# EAGLE design TSOC_USBUART2 (EAGLE 6.6.0)
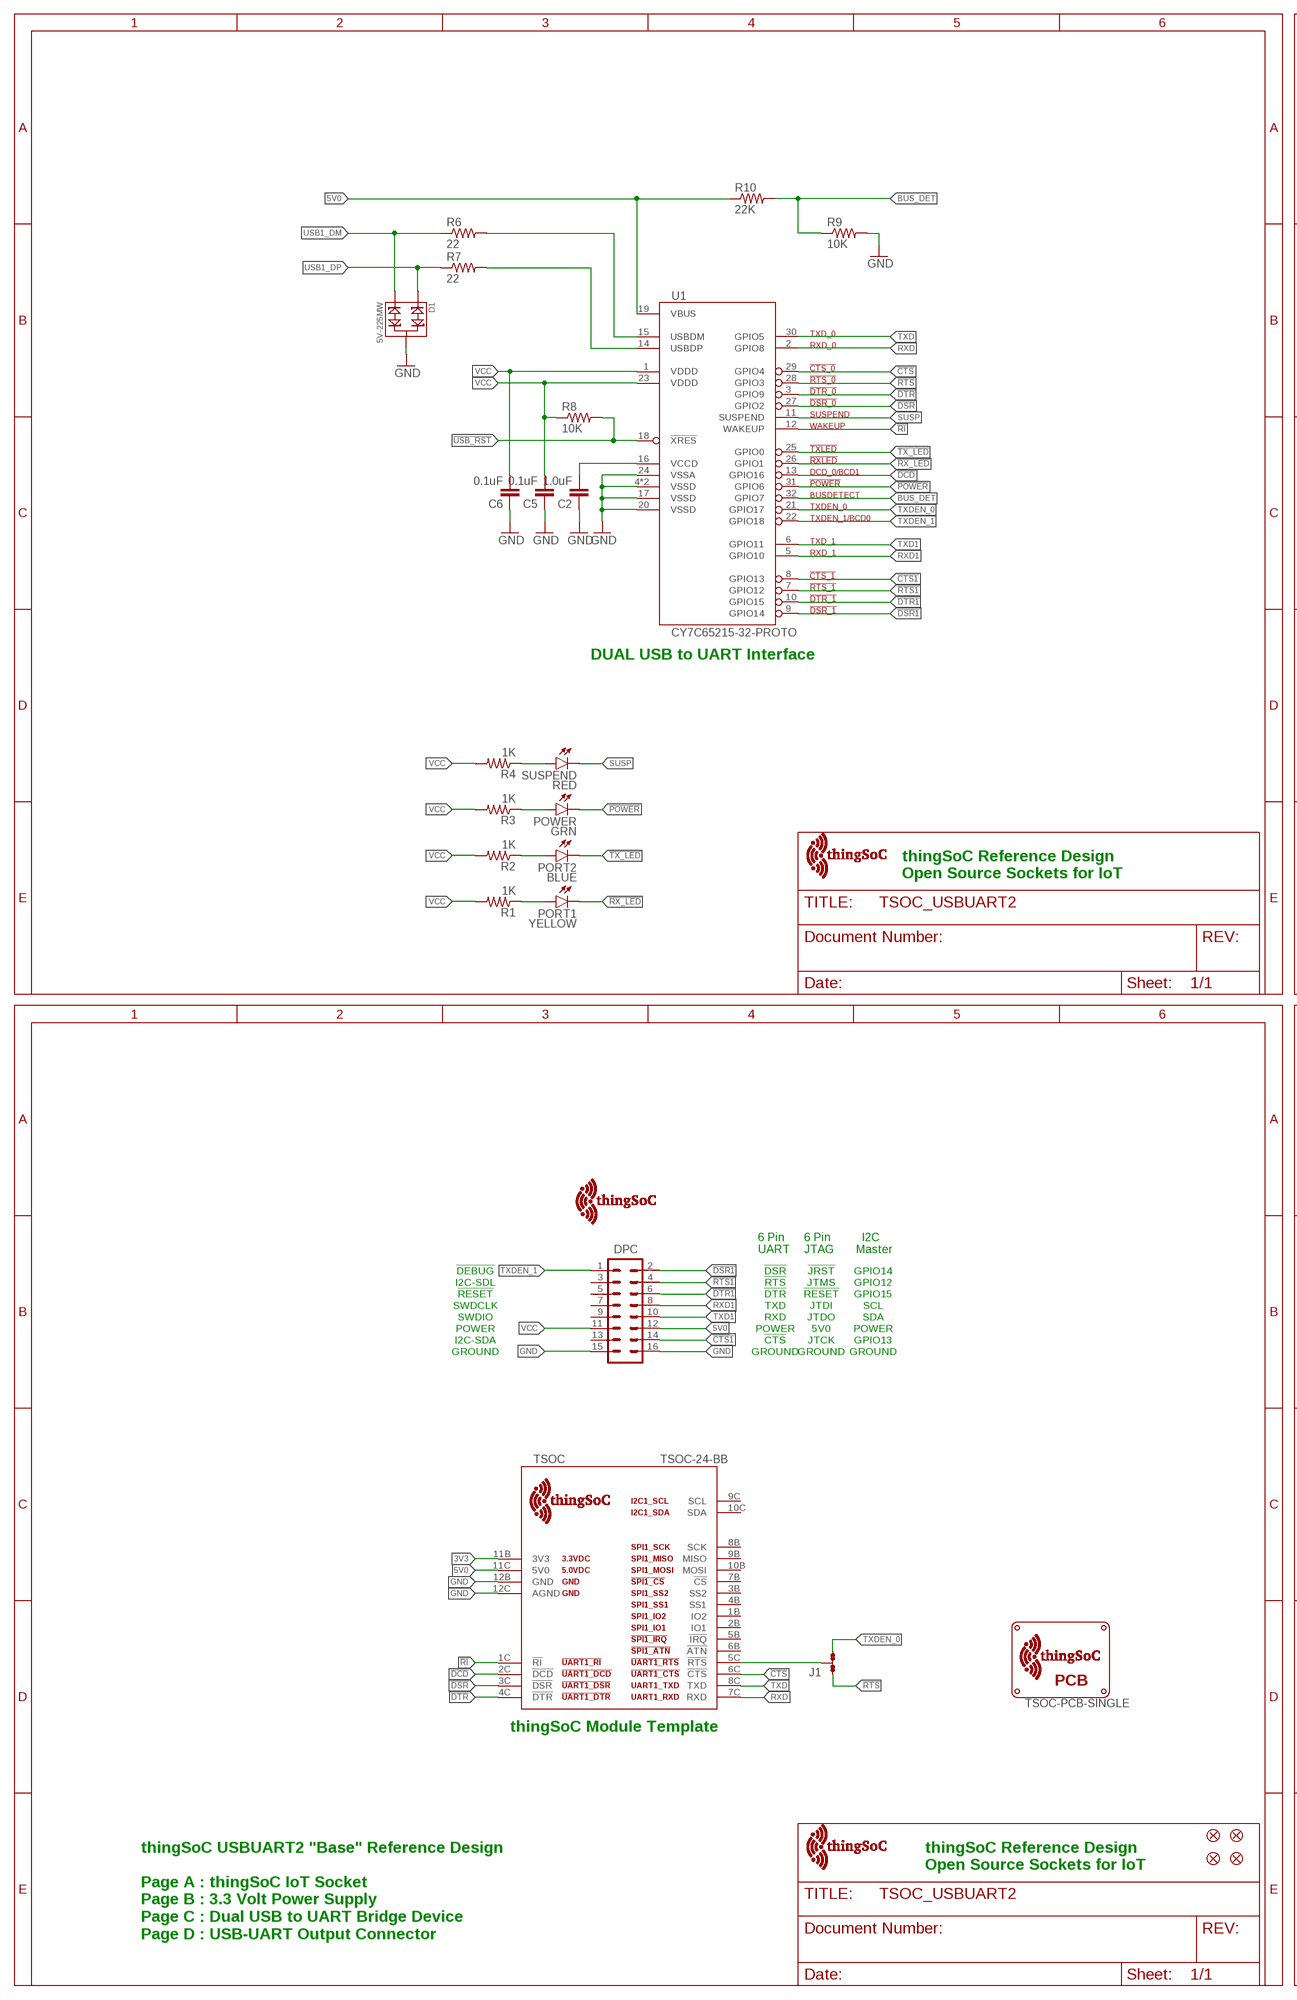
[diagram p0: schematic, sheet 1, part 1 of 2]
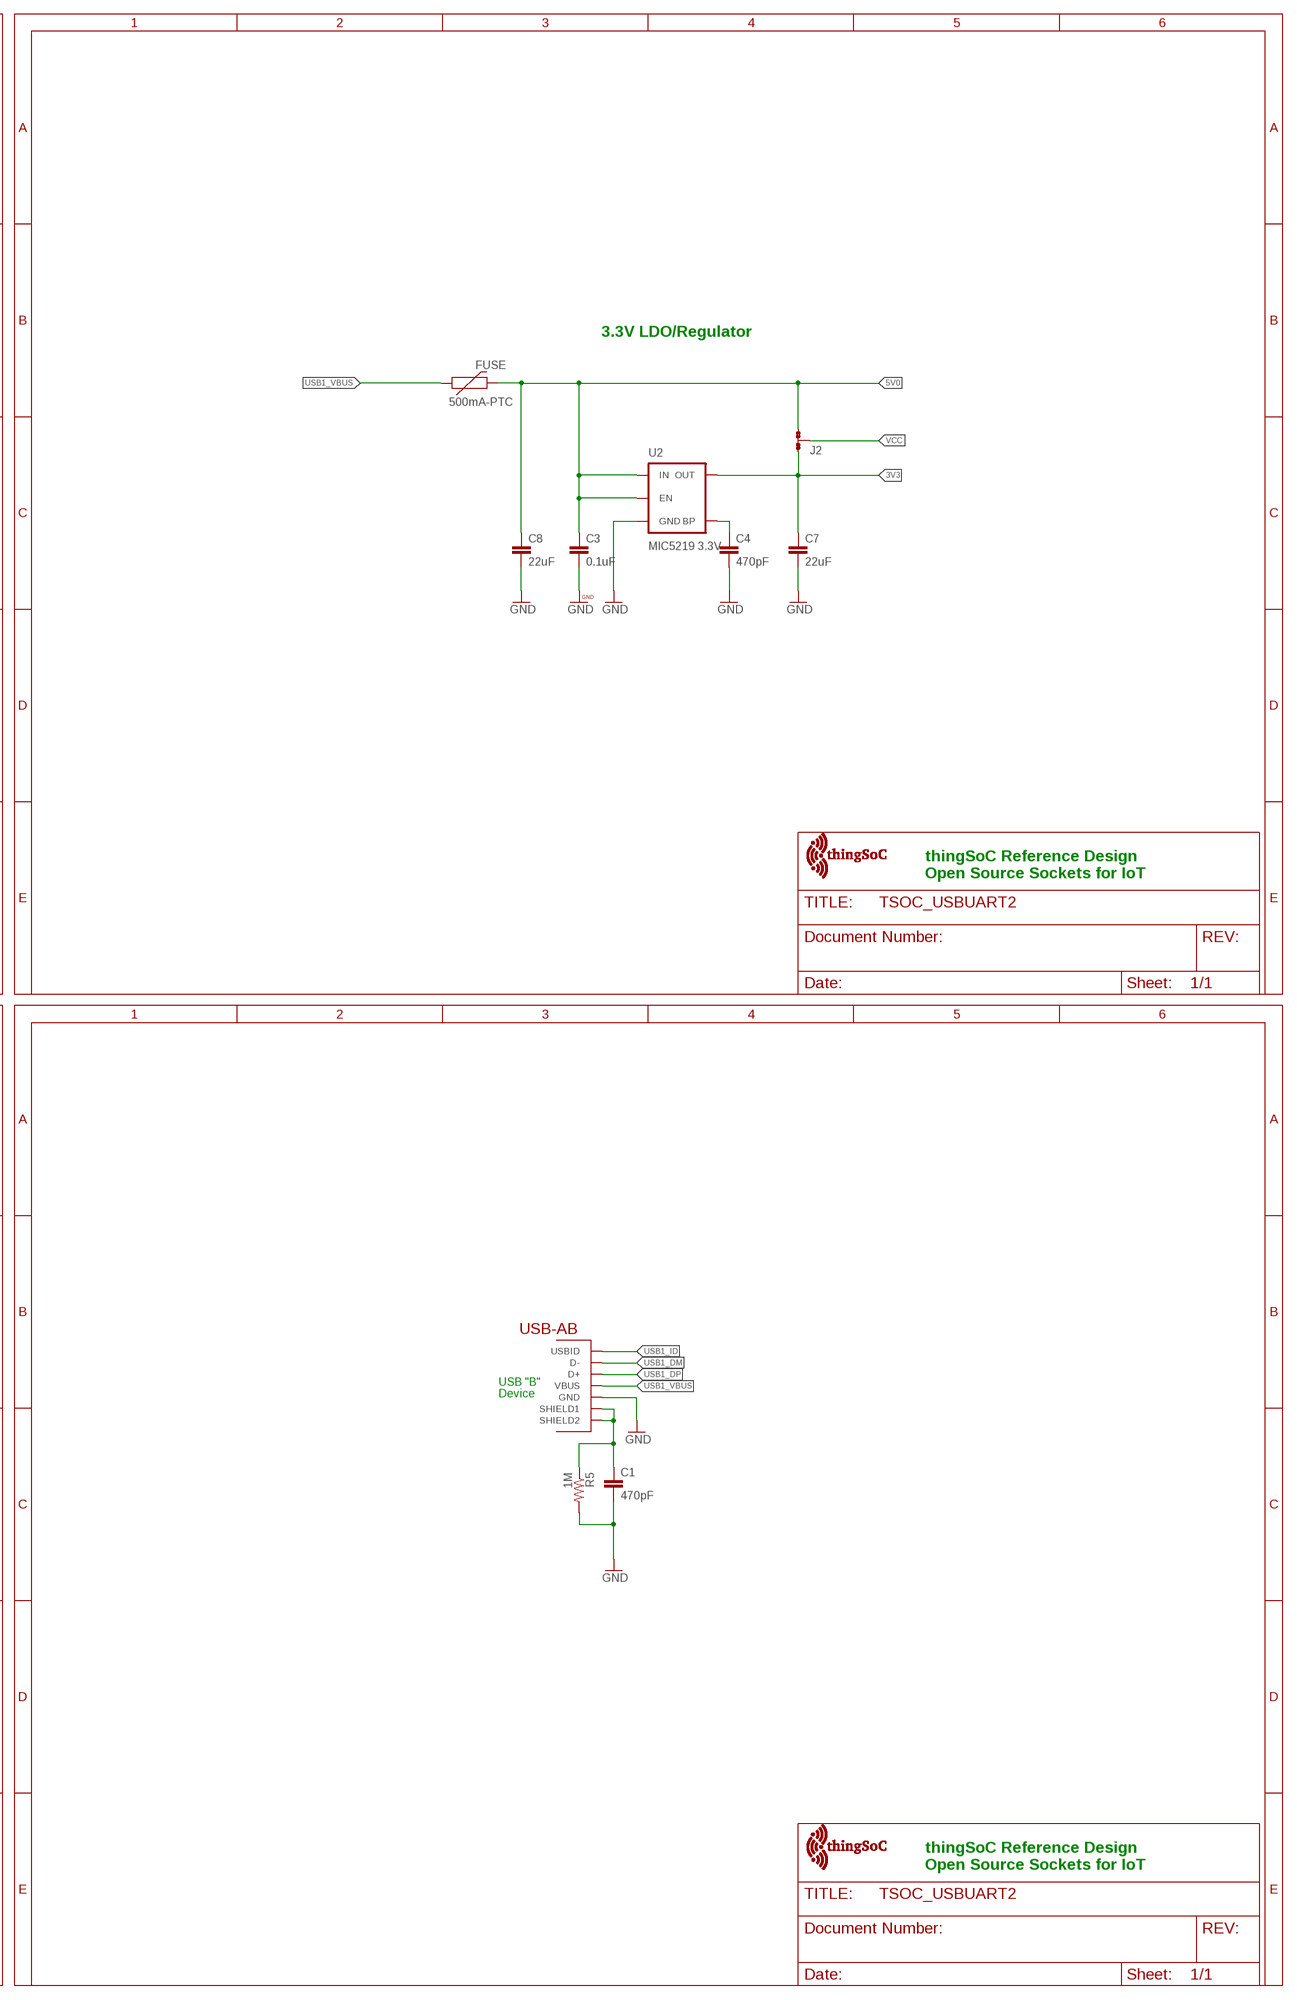
[diagram p1: schematic, sheet 1, part 2 of 2]

## Parts
$$U$2  TSOC-LOGO  [TSOC-LOGO-BLANK]
C1  470pF  CAP-0603  [EIA-0603]
C2  1.0uF  CAP-0603  [EIA-0603]
C3  0.1uF  CAP-0603  [EIA-0603]
C4  470pF  CAP-0603  [EIA-0603]
C5  0.1uF  CAP-0603  [EIA-0603]
C6  0.1uF  CAP-0603  [EIA-0603]
C7  22uF  CAP-1206  [EIA-1206]
C8  22uF  CAP-1206  [EIA-1206]
D1  5V-225MW  SMD-DIODE-TVS-5V-225MW(SOT-23)  [SOT-23]
DPC  M08X2  [2X8]
FID1  FIDUCIALUFIDUCIAL  [MICRO-FIDUCIAL]
FID2  FIDUCIALUFIDUCIAL  [MICRO-FIDUCIAL]
FID3  FIDUCIALUFIDUCIAL  [MICRO-FIDUCIAL]
FID4  FIDUCIALUFIDUCIAL  [MICRO-FIDUCIAL]
FUSE  500mA-PTC  PTCSMD  [PTC-1206]
J1  JMP-3-1_2  [JMP-3-1_2]
J2  JMP-3-1_2  [JMP-3-1_2]
PORT1  YELLOW  LED0603  [LED-0603]
PORT2  BLUE  LED0603  [LED-0603]
POWER  GRN  LED0603  [LED-0603]
R1  1K  RESISTOR-0603  [EIA-0603]
R2  1K  RESISTOR-0603  [EIA-0603]
R3  1K  RESISTOR-0603  [EIA-0603]
R4  1K  RESISTOR-0603  [EIA-0603]
R5  1M  RESISTOR-0603  [EIA-0603]
R6  22  RESISTOR-0603  [EIA-0603]
R7  22  RESISTOR-0603  [EIA-0603]
R8  10K  RESISTOR-0603  [EIA-0603]
R9  10K  RESISTOR-0603  [EIA-0603]
R10  22K  RESISTOR-0603  [EIA-0603]
SUSPEND  RED  LED0603  [LED-0603]
TSOC  TSOC-24-BB  [TSOC-BB-S24]
U1  CY7C65215-32-PROTO  [QFN32-PROTO]
U2  MIC5219 3.3V  V_REG_MIC52193.3V  [SOT23-5]
U$1  TSOC-LOGO  [TSOC-LOGO-BLANK]
U$3  TSOC-LOGO  [TSOC-LOGO-BLANK]
U$4  TSOC-PCB-SINGLE  [TSOC-BB-BRD-DIM]
U$6  TSOC-LOGO-SMALL  [TSOC-LOGO-SML]
U$100  TSOC-LOGO-LRG  [TSOC-LOGO-LRG]
USB  USB_AB  [USB-AB-MICRO-SMD]

## Nets
3V3: C7.1 J2.1 TSOC.11B(3V3) U2.5(OUT)
5V0: C3.1 C8.1 DPC.12 FUSE.2 J2.3 R10.1 TSOC.11C(5V0) U1.19(VBUS) U2.1(IN) U2.3(EN)
!CTS: TSOC.6C(!CTS) U1.29(GPIO4)
!CTS1: DPC.14 U1.8(GPIO13)
!DCD: TSOC.2C(!DCD) U1.13(GPIO16)
!DSR: TSOC.3C(!DSR) U1.27(GPIO2)
!DSR1: DPC.2 U1.9(GPIO14)
!DTR: TSOC.4C(!DTR) U1.3(GPIO9)
!DTR1: DPC.6 U1.10(GPIO15)
!POWER: POWER.C U1.31(GPIO6)
!RI: TSOC.1C(!RI) U1.12(WAKEUP)
!RTS: J1.1 U1.28(GPIO3)
!RTS1: DPC.4 U1.7(GPIO12)
!RX_LED: PORT1.C U1.26(GPIO1)
!TX_LED: PORT2.C U1.25(GPIO0)
!USB_RST: R8.2 U1.18(!XRES)
BLU: PORT2.A R2.1
BUS_DET: R9.1 R10.2 U1.32(GPIO7)
BYPASS1: C4.1 U2.4(BP)
GND [vcc]: C1.2 C2.1 C3.2 C4.2 C5.1 C6.1 C7.2 C8.2 D1.3 DPC.15 DPC.16 R5.2 R9.2 TSOC.12B(GND) TSOC.12C(AGND) U1.4(VSSD) U1.17(VSSD) U1.20(VSSD) U1.24(VSSA) U1.EXP(VSSD) U2.2(GND) USB.GND
GRN: POWER.A R3.1
N$1: J1.2 TSOC.5C(!RTS)
RED: R4.1 SUSPEND.A
RXD: TSOC.7C(RXD) U1.2(GPIO8)
RXD1: DPC.8 U1.5(GPIO10)
SUSP: SUSPEND.C U1.11(SUSPEND)
TXD: TSOC.8C(TXD) U1.30(GPIO5)
TXD1: DPC.10 U1.6(GPIO11)
TXDEN_0: J1.3 U1.21(GPIO17)
TXDEN_1: DPC.1 U1.22(GPIO18)
USB1_DM: D1.2 R6.1 USB.D-
USB1_DP: D1.1 R7.1 USB.D+
USB1_ID: USB.ID(USBID)
USB1_M: R6.2 U1.15(USBDM)
USB1_P: R7.2 U1.14(USBDP)
USB1_SHIELD: C1.1 R5.1 USB.SHIELD1 USB.SHIELD2
USB1_VBUS: FUSE.1 USB.VBUS
VCC: C5.2 C6.2 DPC.11 J2.2 R1.2 R2.2 R3.2 R4.2 R8.1 U1.1(VDDD) U1.23(VDDD)
VCCD1: C2.2 U1.16(VCCD)
YEL: PORT1.A R1.1
Unconnected: DPC.3 DPC.5 DPC.7 DPC.9 DPC.13 TSOC.1B(IO2) TSOC.2B(IO1) TSOC.3B(SS2) TSOC.4B(SS1) TSOC.5B(!IRQ) TSOC.6B(!ATN) TSOC.7B(!CS) TSOC.8B(SCK) TSOC.9B(MISO) TSOC.9C(SCL) TSOC.10B(MOSI) TSOC.10C(SDA)

## Notes on the sheet
- 3.3V LDO/Regulator
- DUAL USB to UART Interface
- thingSoC Reference Design
  Open Source Sockets for IoT
- thingSoC Reference Design
  Open Source Sockets for IoT
- 6 Pin
  UART
- 6 Pin
  JTAG
- I2C
  Master
- !DEBUG | !DSR | !JRST | GPIO14
- I2C-SDL | !RTS | JTMS | GPIO12
- !RESET | !DTR | !RESET | GPIO15
- SWDCLK | TXD | JTDI | SCL
- SWDIO | RXD | JTDO | SDA
- POWER | POWER | 5V0 | POWER
- I2C-SDA | !CTS | JTCK | GPIO13
- GROUND | GROUND | GROUND | GROUND
- USB "B"
- Device
- thingSoC Module Template
- thingSoC Reference Design
  Open Source Sockets for IoT
- thingSoC Reference Design
  Open Source Sockets for IoT
- thingSoC USBUART2 "Base" Reference Design
  
  Page A : thingSoC IoT Socket
  Page B : 3.3 Volt Power Supply
  Page C : Dual USB to UART Bridge Device
  Page D : USB-UART Output Connector

## Library data of the parts
$$U$2 U$1 U$3 U$6 U$100 = thingSoC:TSOC-LOGO: thingSoC Logo Source LBR : http://www.thingsoc.com Github : https://github.com/thingsoc License : http://creativecommons.org/licenses/by-sa/4.0/ (Creative Commons 4.0) THIS SOFTWARE IS PROVIDED BY THE CONTRIBUTORS "AS IS" AND WITHOUT ANY EXPRESS OR IMPLIED WARRANTIES, INCLUDING, BUT NOT LIMITED TO, THE IMPLIED WARRANTIES OF MERCHANTABILITY AND FITNESS FOR A PARTICULAR PURPOSE ARE DISCLAIMED. IN NO EVENT SHALL THE COPYRIGHT OWNER OR CONTRIBUTORS BE LIABLE FOR ANY DIRECT, INDIRECT, INCIDENTAL, SPECIAL, EXEMPLARY, OR CONSEQUENTIAL DAMAGES (INCLUDING, BUT NOT LIMITED TO, PROCUREMENT OF SUBSTITUTE GOODS OR SERVICES; LOSS OF USE, DATA, OR PROFITS; OR BUSINESS INTERRUPTION) HOWEVER CAUSED AND ON ANY THEORY OF LIABILITY, WHETHER IN CONTRACT, STRICT LIABILITY, OR TORT (INCLUDING NEGLIGENCE OR OTHERWISE) ARISING IN ANY WAY OUT OF THE USE OF THIS SOFTWARE, EVEN IF ADVISED OF THE POSSIBILITY OF SUCH DAMAGE.
C1-C8 = TSOC_USBUART2:CAP: Ceramic Capacitor SMD
D1 = Seeed-Diode-2016:SMD-DIODE-TVS-5V-225MW(SOT-23): 304050003; MPN: CESD5V0AP
DPC = PatternAgents-ProtoPads:M08X2: .1" headers, two rows of 8 each
FID1-FID4 = TSOC-ESP8266-BASE:FIDUCIAL: Fiducial Alignment Points Various fiducial points for machine vision alignment.
FUSE = SparkFun:PTC: Resettable Fuse PTC Resettable Fuse. Spark Fun Electronics SKU : COM-08357
J1 J2 = PatternAgents-ProtoPads:JMP-3-1_2: Three Terminal Jumper - 1 & 2 Connected Positions 1and 2 are normally connected. PatternAgents ProtoPads Library Schematic and PCB layout libraries for design patterns by PatternAgents. For the CADSoft Eagle CAD program : http://www.cadsoftusa.com/download-eagle/ Source LBR : http://www.patternagents.com Github : https://github.com/PatternAgents License : http://creativecommons.org/licenses/by-sa/4.0/ (Creative Commons 4.0) THIS SOFTWARE IS PROVIDED BY THE CONTRIBUTORS "AS IS" AND WITHOUT ANY EXPRESS OR IMPLIED WARRANTIES, INCLUDING, BUT NOT LIMITED TO, THE IMPLIED WARRANTIES OF MERCHANTABILITY AND FITNESS FOR A PARTICULAR PURPOSE ARE DISCLAIMED. IN NO EVENT SHALL THE COPYRIGHT OWNER OR CONTRIBUTORS BE LIABLE FOR ANY DIRECT, INDIRECT, INCIDENTAL, SPECIAL, EXEMPLARY, OR CONSEQUENTIAL DAMAGES (INCLUDING, BUT NOT LIMITED TO, PROCUREMENT OF SUBSTITUTE GOODS OR SERVICES; LOSS OF USE, DATA, OR PROFITS; OR BUSINESS INTERRUPTION) HOWEVER CAUSED AND ON ANY THEORY OF LIABILITY, WHETHER IN CONTRACT, STRICT LIABILITY, OR TORT (INCLUDING NEGLIGENCE OR OTHERWISE) ARISING IN ANY WAY OUT OF THE USE OF THIS SOFTWARE, EVEN IF ADVISED OF THE POSSIBILITY OF SUCH DAMAGE.; BOM: EXCLUDE
PORT1 PORT2 POWER SUSPEND = TSOC-ESP8266-BASE:LED: LEDs Standard schematic elements and footprints for 5mm, 3mm, 1206, and 0603 sized LEDs. 5mm - Spark Fun Electronics SKU : COM-00529 (and others)
R1-R10 = TSOC_USBUART2:RESISTOR
TSOC = thingSoC:TSOC-24: thingSoC Twenty-Four(24) Pin Socket Source LBR : http://www.thingsoc.com Github : https://github.com/thingsoc License : http://creativecommons.org/licenses/by-sa/4.0/ (Creative Commons 4.0) THIS SOFTWARE IS PROVIDED BY THE CONTRIBUTORS "AS IS" AND WITHOUT ANY EXPRESS OR IMPLIED WARRANTIES, INCLUDING, BUT NOT LIMITED TO, THE IMPLIED WARRANTIES OF MERCHANTABILITY AND FITNESS FOR A PARTICULAR PURPOSE ARE DISCLAIMED. IN NO EVENT SHALL THE COPYRIGHT OWNER OR CONTRIBUTORS BE LIABLE FOR ANY DIRECT, INDIRECT, INCIDENTAL, SPECIAL, EXEMPLARY, OR CONSEQUENTIAL DAMAGES (INCLUDING, BUT NOT LIMITED TO, PROCUREMENT OF SUBSTITUTE GOODS OR SERVICES; LOSS OF USE, DATA, OR PROFITS; OR BUSINESS INTERRUPTION) HOWEVER CAUSED AND ON ANY THEORY OF LIABILITY, WHETHER IN CONTRACT, STRICT LIABILITY, OR TORT (INCLUDING NEGLIGENCE OR OTHERWISE) ARISING IN ANY WAY OUT OF THE USE OF THIS SOFTWARE, EVEN IF ADVISED OF THE POSSIBILITY OF SUCH DAMAGE.
U1 = PatternAgents-Cypress:CY7C65215-32: Cypress EZ-USB ® CY7C65215-32QFN DUAL CHANNEL USB TO UART/SPI/IC Bridge Full-Speed USB Peripheral Controller Source Data: http://www.cypress.com/?mpn=CY7C65211-24QFN LBR Source: http://www.patternagents.com THIS SOFTWARE IS PROVIDED BY THE CONTRIBUTORS "AS IS" AND WITHOUT ANY EXPRESS OR IMPLIED WARRANTIES, INCLUDING, BUT NOT LIMITED TO, THE IMPLIED WARRANTIES OF MERCHANTABILITY AND FITNESS FOR A PARTICULAR PURPOSE ARE DISCLAIMED. IN NO EVENT SHALL THE COPYRIGHT OWNER OR CONTRIBUTORS BE LIABLE FOR ANY DIRECT, INDIRECT, INCIDENTAL, SPECIAL, EXEMPLARY, OR CONSEQUENTIAL DAMAGES (INCLUDING, BUT NOT LIMITED TO, PROCUREMENT OF SUBSTITUTE GOODS OR SERVICES; LOSS OF USE, DATA, OR PROFITS; OR BUSINESS INTERRUPTION) HOWEVER CAUSED AND ON ANY THEORY OF LIABILITY, WHETHER IN CONTRACT, STRICT LIABILITY, OR TORT (INCLUDING NEGLIGENCE OR OTHERWISE) ARISING IN ANY WAY OUT OF THE USE OF THIS SOFTWARE, EVEN IF ADVISED OF THE POSSIBILITY OF SUCH DAMAGE.
U2 = TSOC-ESP8266-BASE:V_REG_MIC5219: V_REG MIC5219 Standard 3.3V and 5V 500mA LDO voltage regulator in SOT-23 layout. Micrel part MIC5219. BP (by-pass) pin is used to lower output noise with 470pF cap, may be left open.; PROD_ID: VREG-09872
U$4 = thingSoC:TSOC-PCB: thingSoC PCB Outlines Boards Outlines for Standard Sizes (in the DImension Layer) (Registration marks in the tDocu layer - make sure to turn on tDocu/bDocu) Source LBR : http://www.thingsoc.com Github : https://github.com/thingsoc License : http://creativecommons.org/licenses/by-sa/4.0/ (Creative Commons 4.0) THIS SOFTWARE IS PROVIDED BY THE CONTRIBUTORS "AS IS" AND WITHOUT ANY EXPRESS OR IMPLIED WARRANTIES, INCLUDING, BUT NOT LIMITED TO, THE IMPLIED WARRANTIES OF MERCHANTABILITY AND FITNESS FOR A PARTICULAR PURPOSE ARE DISCLAIMED. IN NO EVENT SHALL THE COPYRIGHT OWNER OR CONTRIBUTORS BE LIABLE FOR ANY DIRECT, INDIRECT, INCIDENTAL, SPECIAL, EXEMPLARY, OR CONSEQUENTIAL DAMAGES (INCLUDING, BUT NOT LIMITED TO, PROCUREMENT OF SUBSTITUTE GOODS OR SERVICES; LOSS OF USE, DATA, OR PROFITS; OR BUSINESS INTERRUPTION) HOWEVER CAUSED AND ON ANY THEORY OF LIABILITY, WHETHER IN CONTRACT, STRICT LIABILITY, OR TORT (INCLUDING NEGLIGENCE OR OTHERWISE) ARISING IN ANY WAY OUT OF THE USE OF THIS SOFTWARE, EVEN IF ADVISED OF THE POSSIBILITY OF SUCH DAMAGE.
USB = BeeSafe:USB_AB: This is a USB AB connector that is compatible with USB OTG. i.e. this connector can serve as a host or device

## Net classes
1 vcc: width 0.254 mm

## Board
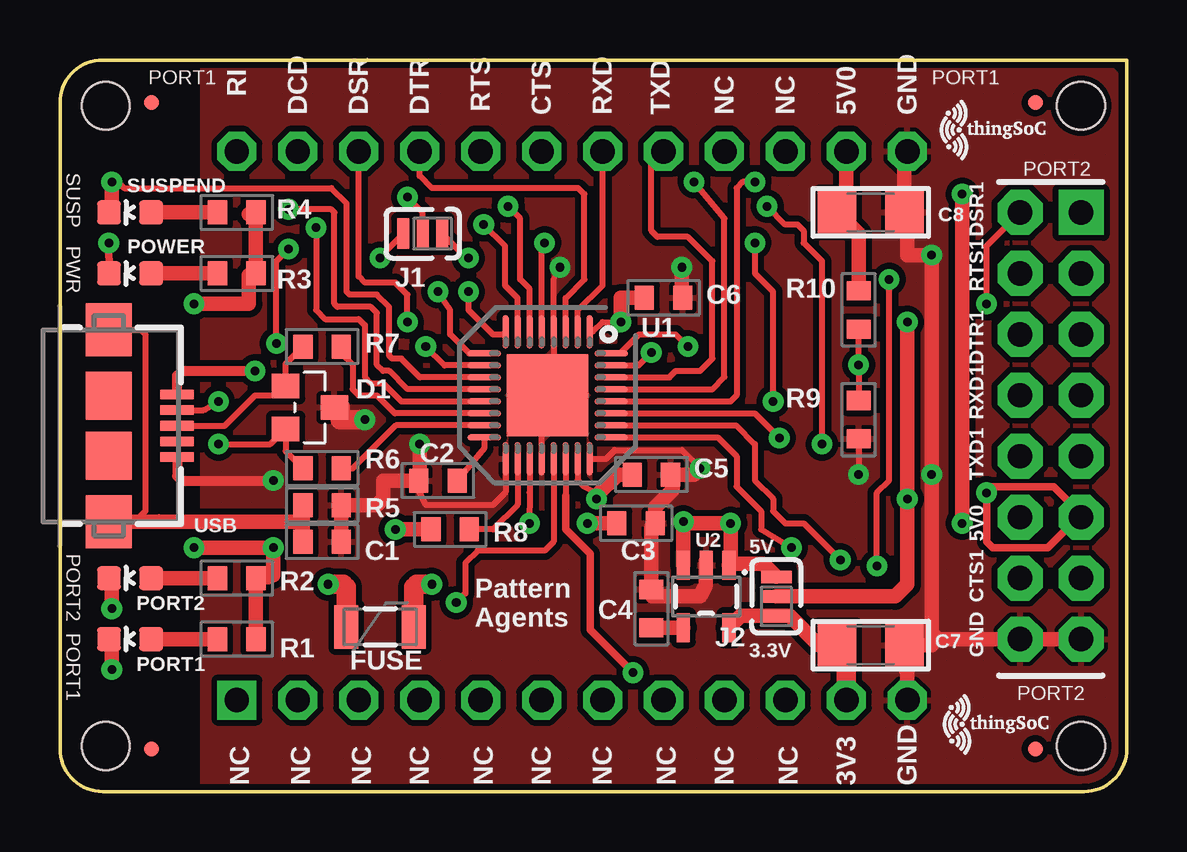
[diagram p2: board, top side]
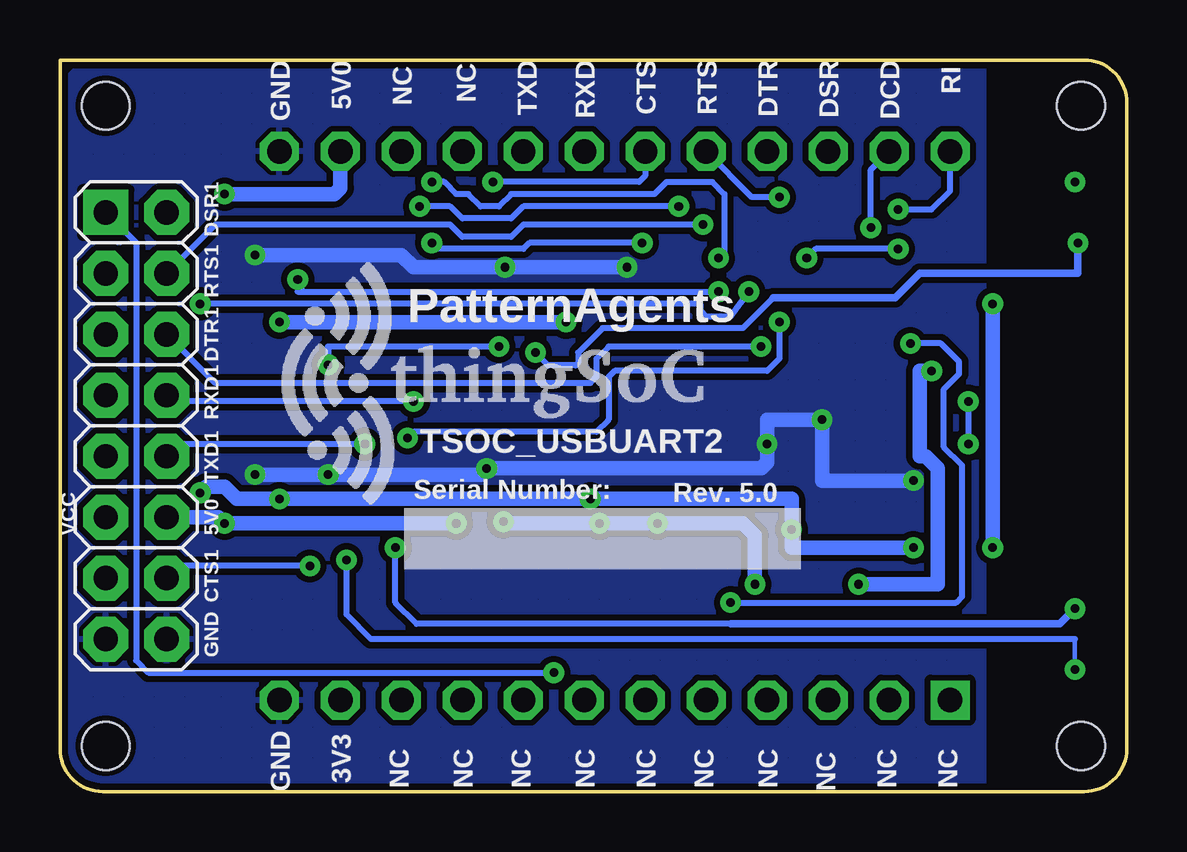
[diagram p3: board, bottom side, seen from below]

Size 44.45 x 30.48 mm. Coordinates in mm from the lower left corner, seen from the top.
Copper layers (1*16): Top 0.035mm / dielectric 1.5mm / Bottom 0.035mm
Design rules "PatternAgents_7mil": minimum track width 7mil, minimum drill 14mil, track to track 7mil, track to pad 7mil, pad to pad 7mil, via to via 7mil, smd to smd 7mil, copper to edge 7mil, drill to drill 7mil, minimum pad ring 12mil, minimum via ring 10mil, stop-mask expansion 4mil, vias tented up to drill 25mil, thermal gap 7mil

### Footprints (pad centres in the part's own frame; a part is rotated, then mirrored left to right if it is on the bottom)
EIA-0603 = smd 0.8 x 1: 1 -0.8,0; 2 0.8,0
EIA-1206 = smd 1.6 x 1.8: 1 -1.4,0; 2 1.4,0
SOT-23 = smd 1.016 x 1.143: 1 -0.889,-1.016; 2 0.889,-1.016; 3 0,1.016
2X8 = drill 1.016 pad 1.88 square: 1 0,0 | drill 1.016 pad 1.88 octagon: 2 0,2.54; 3 2.54,0; 4 2.54,2.54; 5 5.08,0; 6 5.08,2.54; 7 7.62,0; 8 7.62,2.54; 9 10.16,0; 10 10.16,2.54; 11 12.7,0; 12 12.7,2.54; 13 15.24,0; 14 15.24,2.54; 15 17.78,0; 16 17.78,2.54
MICRO-FIDUCIAL = smd 0.635 x 0.635: 1 0,0
PTC-1206 = smd 1 x 1.8: 1 -1.4,0; 2 1.4,0
JMP-3-1_2 = smd 0.508 x 1.27: 1 -0.813,0; 2 0,0; 3 0.813,0
LED-0603 = smd 1 x 1: A 0,-0.877; C 0,0.877
TSOC-BB-S24 = drill 1.016 square: 1B -11.43,11.43 | drill 1.016 octagon: 1C 11.43,11.43; 2B -11.43,8.89; 2C 11.43,8.89; 3B -11.43,6.35; 3C 11.43,6.35; 4B -11.43,3.81; 4C 11.43,3.81; 5B -11.43,1.27; 5C 11.43,1.27; 6B -11.43,-1.27; 6C 11.43,-1.27; 7B -11.43,-3.81; 7C 11.43,-3.81; 8B -11.43,-6.35; 8C 11.43,-6.35; 9B -11.43,-8.89; 9C 11.43,-8.89; 10B -11.43,-11.43; 10C 11.43,-11.43; 11B -11.43,-13.97; 11C 11.43,-13.97; 12B -11.43,-16.51; 12C 11.43,-16.51
QFN32-PROTO = smd 1.4 x 0.254: 1 -2.65,1.75; 2 -2.65,1.25; 3 -2.65,0.75; 4 -2.65,0.25; 5 -2.65,-0.25; 6 -2.65,-0.75; 7 -2.65,-1.25; 8 -2.65,-1.75; 17 2.65,-1.75; 18 2.65,-1.25; 19 2.65,-0.75; 20 2.65,-0.25; 21 2.65,0.25; 22 2.65,0.75; 23 2.65,1.25; 24 2.65,1.75 | smd 0.254 x 1.4: 9 -1.75,-2.65; 10 -1.25,-2.65; 11 -0.75,-2.65; 12 -0.25,-2.65; 13 0.25,-2.65; 14 0.75,-2.65; 15 1.25,-2.65; 16 1.75,-2.65; 25 1.75,2.65; 26 1.25,2.65; 27 0.75,2.65; 28 0.25,2.65; 29 -0.25,2.65; 30 -0.75,2.65; 31 -1.25,2.65; 32 -1.75,2.65 | smd 3.4 x 3.4: EXP 0,0
SOT23-5 = smd 0.55 x 1.2: 1 -0.95,-1.3; 2 0,-1.3; 3 0.95,-1.3; 4 0.95,1.3; 5 -0.95,1.3
TSOC-BB-BRD-DIM = hole 2: 13.335,16.891; -13.335,16.891; 13.335,-23.749; -13.335,-23.749
USB-AB-MICRO-SMD = smd 1.4 x 0.4: D+ 2.85,0; D- 2.85,0.65; GND 2.85,-1.3; ID 2.85,-0.65; VBUS 2.85,1.3 | smd 1.9 x 2: P$6 0,1.25; P$7 0,-1.25 | smd 1.9 x 2.2: SHIELD1 0,4; SHIELD2 0,-4

### Placement (x,y rotation side)
$$U$2  3.81,1.78 0 top
C1  10.92,10.41 0 top
C2  15.75,12.95 0 top
C3  24,11.18 0 top
C4  24.64,7.62 90 top
C5  24.64,13.21 180 top
C6  25.15,20.57 180 top
C7  33.78,6.1 0 top
C8  33.78,24.13 0 top
D1  10.41,16 270 top
DPC  42.55,24.13 270 bottom
FID1  3.81,1.78 0 top
FID2  3.81,28.7 0 top
FID3  40.64,1.78 0 top
FID4  40.64,28.7 0 top
FUSE  13.34,6.86 0 top
J1  15.11,23.24 180 top
J2  29.84,8.13 90 top
PORT1  2.92,6.35 90 top
PORT2  2.92,8.89 90 top
POWER  2.92,21.59 90 top
R1  7.37,6.35 0 top
R2  7.37,8.89 0 top
R3  7.37,21.59 0 top
R4  7.37,24.13 0 top
R5  10.92,11.94 0 top
R6  10.92,13.46 0 top
R7  10.92,18.54 0 top
R8  16.26,10.92 0 top
R9  33.27,15.49 270 top
R10  33.27,20.07 270 top
SUSPEND  2.92,24.13 90 top
TSOC  18.8,15.24 90 top
U1  20.32,16.51 270 top
U2  26.92,8.13 180 top
U$1  3.81,1.78 0 top
U$3  3.81,1.78 0 top
U$4  18.8,15.24 90 top
U$5  TSOC-LOGO-SMALL  [TSOC-LOGO-SML]  37.59,2.79 0 top
U$6  37.47,27.56 0 top
U$100  32,17.02 0 bottom
USB  2.03,15.24 0 top

### Tracks (layer width: path | path; a pad name or v marks a point on that pad's centre or on a via)
3V3
  Top 0.61: C7.1 31.62,6.1 30.4,7.32 J2.1 28.36,7.32 U2.5
  Top 0.813: TSOC.11B 32.77,5.71 C7.1
5V0  (via drill 0.36)
  Top 0.254: U1.19 19.57,12.46 v19.56,11.18
  Top 0.61: v25.97,11.24 25.91,11.18 v27.94,11.18 27.94,9.49 | 27.94,9.49 U2.1 | v25.97,11.24 U2.3 | v25.97,11.25 v25.97,11.24 | 32.51,24 C8.1 | v25.97,11.24 25.97,11.36 | v37.59,11.18 v37.59,24.89 | 33.31,20.83 R10.1 33.27,23.24 C8.1 | TSOC.11C 32.77,24.51 C8.1 | C3.1 v21.97,11.18 | 27.94,9.49 29.29,9.49 J2.3
  Top 0.813: FUSE.2 14.73,8.51 14.86,8.64 v15.49,8.64
  Bottom 0.61: v27.94,11.18 v37.59,11.18 37.85,11.43 DPC.12 | v25.97,11.24 25.91,11.18 v21.97,11.18 v19.56,11.18 16,11.18 15.49,10.67 v15.49,8.64 | v37.59,24.89 33.02,24.89 32.77,25.15 TSOC.11C
!CTS  (via drill 0.36)
  Top 0.254: U1.29 27.17,16.76 27.69,17.27 27.69,23.88 v26.42,25.4
  Bottom 0.254: TSOC.6C 20.07,25.65 20.32,25.4 v26.42,25.4
!CTS1  (via drill 0.36)
  Top 0.254: v17.02,20.83 17.02,20.07 18.03,19.05 18.46,19.05 U1.8 | v34.04,9.4 34.04,12.45 34.54,12.95 v34.54,21.34
  Bottom 0.254: 34.54,20.83 34.29,20.83 | 34.29,20.83 v17.02,20.83 | v34.54,21.34 34.54,21.08 34.29,20.83 | v34.04,9.4 39.5,9.4 DPC.14
!DCD  (via drill 0.36)
  Top 0.254: U1.13 14.22,16.26 13.46,17.02 12.95,17.02 12.7,17.27 12.7,19.43 12.45,19.68 11.05,19.68 10.67,20.07 v10.67,23.5
  Bottom 0.254: v10.67,23.5 10.67,25.91 TSOC.2C
!DSR  (via drill 0.36)
  Top 0.254: v29.97,14.73 28.94,15.76 U1.27 | v14.48,19.56 14.48,20.7 13.97,21.21 12.7,21.21 12.45,21.46 TSOC.3C
  Bottom 0.254: v14.48,19.56 14.48,18.03 14.99,17.53 21.34,17.53 21.59,17.27 21.59,15.49 22.1,14.99 29.72,14.99 v29.97,14.73
!DSR1  (via drill 0.36)
  Top 0.254: U1.9 17.05,18.26 16.26,19.05 16.26,20.07 v15.75,20.83 | v38.61,20.32 38.61,22.73 DPC.2
  Bottom 0.254: v15.75,20.83 16.51,19.81 17.53,19.81 17.78,20.07 17.78,20.32 v38.61,20.32
!DTR
  Top 0.254: TSOC.4C 14.99,25.65 15.49,25.15 21.59,25.15 21.84,24.89 21.84,21.34 21.07,20.56 U1.3
!DTR1  (via drill 0.36)
  Top 0.254: U1.10 16.02,17.76 v15.24,18.54
  Bottom 0.254: v15.24,18.54 21.59,18.54 22.1,18.03 22.1,17.27 22.35,17.02 37.97,17.02 DPC.6
!POWER  (via drill 0.36)
  Top 0.254: U1.31 24.11,17.76 v24.64,18.29
  Top 0.305: v2.03,22.86 POWER.C
  Bottom 0.254: 14.73,20.57 16,19.3 21.84,19.3 22.86,18.29 22.86,17.87 U1.31 24.11,17.76 v24.64,18.29
  Bottom 0.305: 14.73,20.57 9.65,20.57 8.64,21.59 POWER.C 2.04,22.85 v2.03,22.86
!RI  (via drill 0.36)
  Top 0.254: U1.12 14.48,16.76 13.72,17.53 13.46,17.53 13.21,17.78 13.21,19.94 12.95,20.19 11.56,20.19 11.43,20.32 11.43,24.13 11.3,24.26 v9.53,24.26
  Bottom 0.254: v9.53,24.26 8.13,24.26 7.37,25.02 TSOC.1C
!RTS  (via drill 0.36)
  Top 0.254: U1.28 27.94,16.26 28.19,16.51 28.19,25.15 28.45,25.4 v28.96,25.4 | v17.02,22.23 16.94,22.23 J1.1
  Bottom 0.254: v28.96,25.4 28.45,25.4 27.94,24.89 27.43,24.89 26.92,24.38 26.16,24.38 25.65,24.89 19.68,24.89 19.18,25.4 17.27,25.4 16.76,24.89 16.76,22.48 v17.02,22.23
!RTS1  (via drill 0.36)
  Top 0.254: U1.7 19.07,20.55 18.54,21.08 18.54,22.73 v17.65,23.62
  Bottom 0.254: v17.65,23.62 25.15,23.62 25.65,23.11 27.69,23.11 28.19,23.62 37.97,23.62 DPC.4
!RX_LED  (via drill 0.36)
  Top 0.254: U1.26 28.17,15.26 28.96,14.48 28.96,12.95 29.72,12.19 29.72,11.68 30.23,11.18 30.99,11.18 v32.51,9.65
  Top 0.61: PORT1.C 2.16,6.35 v2.16,5.08
  Bottom 0.178: v2.16,5.08 2.16,6.35
  Bottom 0.254: 32.38,9.65 v32.51,9.65 32.51,7.37 31.5,6.35 2.16,6.35
!TX_LED  (via drill 0.36)
  Top 0.254: U1.25 27.4,14.76 28.19,13.97 28.19,12.7 29.21,11.68 29.21,10.92 v30.48,10.16
  Top 0.61: PORT2.C 2.16,8.89 v2.16,7.62
  Bottom 0.254: 16.51,6.99 29.59,6.99 30.48,7.87 v30.48,10.16
  Bottom 0.305: 16.51,6.99 2.79,6.99 v2.16,7.62
!USB_RST
  Top 0.254: U1.18 19.07,11.96 18.03,10.92 R8.2
BLU
  Top 0.61: R2.1 PORT2.A
BUS_DET  (via drill 0.36)
  Top 0.254: R10.2 v33.27,17.78 R9.1 | U1.32 23.34,18.26 24.13,19.05 25.65,19.05 v26.16,18.54
  Bottom 0.254: v26.16,18.54 33.27,18.54 v33.27,17.78
BYPASS1
  Top 0.61: U2.4 24.85,6.83 C4.1
GND  (via drill 0.36)
  Top 0.254: v20.83,21.84 20.57,21.34 U1.4 20.57,16.76 U1.EXP 20.07,16.26 U1.20 | U1.24 22.75,13.86 23.11,14.22 25.91,14.22 v26.67,13.46 | R9.2 v33.27,13.21 | 14.99,13.03 C2.1 14.99,13.17 14.99,12.45 15.24,11.94 18.03,11.94 18.57,12.47 U1.17 | U2.2 26.85,9.53 27.03,9.53 U2.2 | U2.2 26.85,9.35 26.93,9.44 26.9,9.42 U2.2 | 35.26,5.51 C7.2 | 35.26,5.69 C7.2 | 36.35,7.64 36.32,7.62 | U2.2 26.9,9.6 26.93,9.6 | 35.08,4.98 35.31,4.98 | 35.18,3.94 35.08,3.91 TSOC.12B 35.26,3.91 35.26,3.94 | C7.2 35.26,6.04 35.26,5.97 | C7.2 35.08,6.04 35.05,5.97
  Top 0.406: USB.GND 4.88,13.15 5.08,12.95 v8.89,12.95
  Top 0.61: C1.2 R5.2 13.21,11.94 13.46,12.19 13.46,12.95 C2.1 14.99,13.25 v14.99,14.48 | C6.1 25.91,20.57 v25.91,21.84 | 26.9,9.6 26.9,8.61 26.67,8.13 24.68,8.13 C4.2 24.64,11.01 C3.2 24.8,11.85 25.53,12.57 25.53,13.12 C5.1 26.42,13.21 v26.67,13.46 | TSOC.12C 35.18,26.55 C8.2 35.31,24.01 35.31,22.35 v36.32,22.35 v36.32,13.21 36.32,7.62 36.32,6.6 | 36.32,6.6 36.32,6.1 C7.2 35.31,5.97 35.31,4.98 TSOC.12B | DPC.15 DPC.16 36.58,6.35 36.32,6.6
  Top 0.813: D1.3 11.68,16 11.68,15.49 v12.7,15.49
  Bottom 0.61: v20.83,21.84 v25.91,21.84 29.72,21.84 30.23,22.35 v36.32,22.35 | v36.32,13.21 v33.27,13.21 26.92,13.21 v26.67,13.46 15.24,13.46 14.99,13.72 v14.99,14.48 14.99,15.49 v12.7,15.49 12.7,12.95 v8.89,12.95
  pour Top (isolate 0.254, hatched): 5.97,30.48 42.64,30.48 arc-90 44.45,28.67 44.45,1.81 arc-90 42.64,0 5.97,0
  pour Bottom (isolate 0.254, hatched): 5.97,30.48 42.65,30.48 arc-90 44.45,28.68 44.45,1.81 arc-90 42.64,0 5.97,0
GRN
  Top 0.61: R3.1 POWER.A
N$1  (via drill 0.36)
  Top 0.254: J1.2 15.11,24.13 v14.48,24.77
  Bottom 0.254: v14.48,24.77 15.62,24.77 TSOC.5C
RED
  Top 0.61: R4.1 SUSPEND.A
RXD
  Top 0.254: U1.2 21.57,20.05 22.61,21.08 TSOC.7C
RXD1  (via drill 0.36)
  Top 0.254: U1.5 20.07,22.74 v20.19,22.86 | v29.72,16.26 29.72,20.83 28.96,21.59 v28.96,22.86
  Bottom 0.254: v20.19,22.86 24.89,22.86 25.15,22.61 28.96,22.61 v28.96,22.86 | v29.72,16.26 39.75,16.26 DPC.8
SUSP  (via drill 0.36)
  Top 0.254: v2.16,25.4 2.41,25.4 2.67,25.15 11.3,25.15 11.94,24.51 11.94,20.83 12.06,20.7 13.21,20.7 13.72,20.19 13.72,18.16 13.84,18.03 14.22,18.03 15,17.26 U1.11
  Top 0.61: SUSPEND.C 2.16,24.13 v2.16,25.4
TXD
  Top 0.254: U1.30 25.39,17.26 25.65,17.53 26.67,17.53 27.18,18.03 27.18,22.1 26.16,23.11 24.89,23.11 24.64,23.37 24.64,26.16 TSOC.8C
TXD1  (via drill 0.36)
  Top 0.254: v31.75,14.48 31.75,22.1 30.99,22.86 30.99,23.37 30.73,23.62 30.23,23.62 v29.46,24.38 | U1.6 19.57,20.94 19.18,21.34 19.18,23.88 v18.67,24.38
  Bottom 0.254: v18.67,24.38 25.15,24.38 25.65,23.88 27.69,23.88 28.19,24.38 v29.46,24.38 | v31.75,14.48 39.5,14.48 DPC.10
TXDEN_0  (via drill 0.36)
  Top 0.254: U1.21 20.57,10.41 20.19,10.03 17.4,10.03 16.89,9.53 16.89,8.26 v16.51,7.87 | v9.02,18.67 9.02,22.1 v9.53,22.61 | v13.34,22.23 13.34,22.28 J1.3
  Bottom 0.254: v16.51,7.87 7.11,7.87 6.86,8.13 6.86,13.59 7.62,14.35 7.62,16.76 6.99,17.4 6.99,17.91 7.75,18.67 v9.02,18.67 | v9.53,22.61 12.95,22.61 v13.34,22.23
TXDEN_1  (via drill 0.36)
  Top 0.254: U1.22 21.07,12.33
  Top 0.305: 21.07,12.33 21.07,10.93 22.1,9.91 22.1,6.73 v23.88,4.95
  Bottom 0.254: DPC.1 41.27,22.86 41.27,5.46 40.77,4.95 v23.88,4.95
USB1_DM  (via drill 0.36)
  Top 0.254: USB.D- 5.98,15.89 v6.6,16.26 | R6.1 9.4,14.19 D1.2 8.76,14.48 v6.6,14.48
  Bottom 0.254: v6.6,16.26 v6.6,14.48
USB1_DP
  Top 0.254: USB.D+ 6.86,15.24 8.13,16.51 9.02,16.51 D1.1 9.4,17.82 R7.1
USB1_M
  Top 0.254: U1.15 13.99,15.26 12.19,13.46 R6.2
USB1_P
  Top 0.254: U1.14 13.96,15.76 13.21,16.51 12.45,16.51 12.19,16.76 12.19,17.78 11.72,18.25 R7.2
USB1_SHIELD
  Top 0.254: USB.SHIELD1 3.37,19.24 3.56,19.05 3.56,11.68 3.3,11.43 4.13,11.43 USB.SHIELD2
  Top 0.61: USB.SHIELD2 9.93,11.24 10.12,11.05 | C1.1 10.12,11.05 | 10.12,11.05 R5.1
USB1_VBUS  (via drill 0.36)
  Top 0.406: USB.VBUS 4.88,17.33 5.08,17.53 v8.13,17.53
  Top 0.813: FUSE.1 11.94,8.51 11.81,8.64 v11.18,8.64
  Bottom 0.61: v11.18,8.64 7.87,8.64 7.87,13.46 8.38,13.97 8.64,13.97 8.64,17.53 v8.13,17.53
VCC  (via drill 0.36)
  Top 0.254: U1.1 22.21,19.16 22.61,19.56 v23.37,19.56 | U1.23 21.57,12.97 21.84,12.7 22.35,12.45 v22.35,12.19
  Top 0.305: DPC.11 42.55,11.56 41.4,12.7 38.86,12.7 v38.61,12.45 38.61,10.41 38.86,10.16 41.15,10.16 42.42,11.43
  Top 0.61: 7.87,24.06 R4.2 R3.2 7.87,21.52 7.87,20.32 v5.59,20.32 | R1.2 R2.2 8.13,8.93 8.67,8.93 8.89,9.02 v8.89,10.16 v5.59,10.16 | C6.2 23.37,20.57 v23.37,19.56 | R8.1 v13.97,10.92 | v35.31,19.56 v35.31,12.19 35.31,8.64 34.8,8.13 J2.2 | v22.35,12.19 22.35,12.32 23.24,13.21 C5.2
  Bottom 0.61: v35.31,19.56 v23.37,19.56 | v8.89,10.16 13.97,10.16 v13.97,10.92 13.97,12.19 v22.35,12.19 v35.31,12.19 37.08,12.19 37.59,12.7 38.35,12.7 v38.61,12.45 | v5.59,10.16 v5.59,20.32
VCCD1
  Top 0.254: U1.16 17.67,14.3 C2.2
YEL
  Top 0.61: R1.1 PORT1.A

### Text on the board
tPlace: PORT1 | RI | PORT1 | DCD | DSR | DTR | RTS | CTS | RXD | TXD | NC | NC | 5V0 | GND | SUSP | PORT2 | PWR | DSR1 | RTS1 | DTR1 | RXD1 | TXD1 | PORT2 | 5V | 5V0 | CTS1 | PORT1 | Pattern / Agents | 3.3V | GND | PORT2 | NC | NC | NC | NC | NC | NC | NC | NC | NC | NC | 3V3 | GND
bPlace: RI | DCD | DSR | DTR | RTS | CTS | RXD | TXD | NC | NC | 5V0 | GND | DSR1 | RTS1 | PatternAgents | DTR1 | RXD1 | TSOC_USBUART2 | TXD1 | Rev. 5.0 | Serial Number: | 5V0 | VCC | CTS1 | GND | GND | NC | NC | NC | NC | NC | NC | NC | NC | NC | NC | 3V3